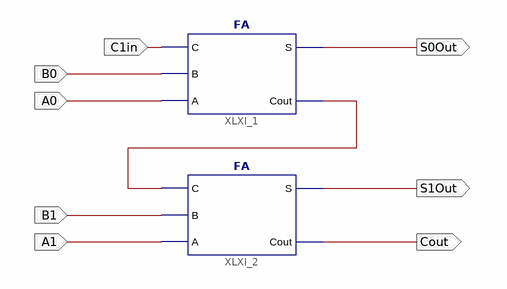
[diagram p0: schematic sheet 1]
// Xilinx ISE schematic addr2b.sch (spartan3e) as structural Verilog: 2 symbols, 8 ports
module addr2b (
  input  B0,
  input  B1,
  input  A1,
  input  A0,
  input  C1in,
  output S0Out,
  output S1Out,
  output Cout
);

  wire XLXN_4;

  FA XLXI_1 (.C(C1in), .B(B0), .A(A0), .S(S0Out), .Cout(XLXN_4));
  FA XLXI_2 (.C(XLXN_4), .B(B1), .A(A1), .S(S1Out), .Cout(Cout));
endmodule
